# EasyEDA schematic SCH_Satlla_4_Front_side_2023-01-29.json
TITLE: Front_Side; REV: 1.0; Date: 2021-02-23; Sheet: 1/1; Drawn By: KCG LAB; Company: K&CG
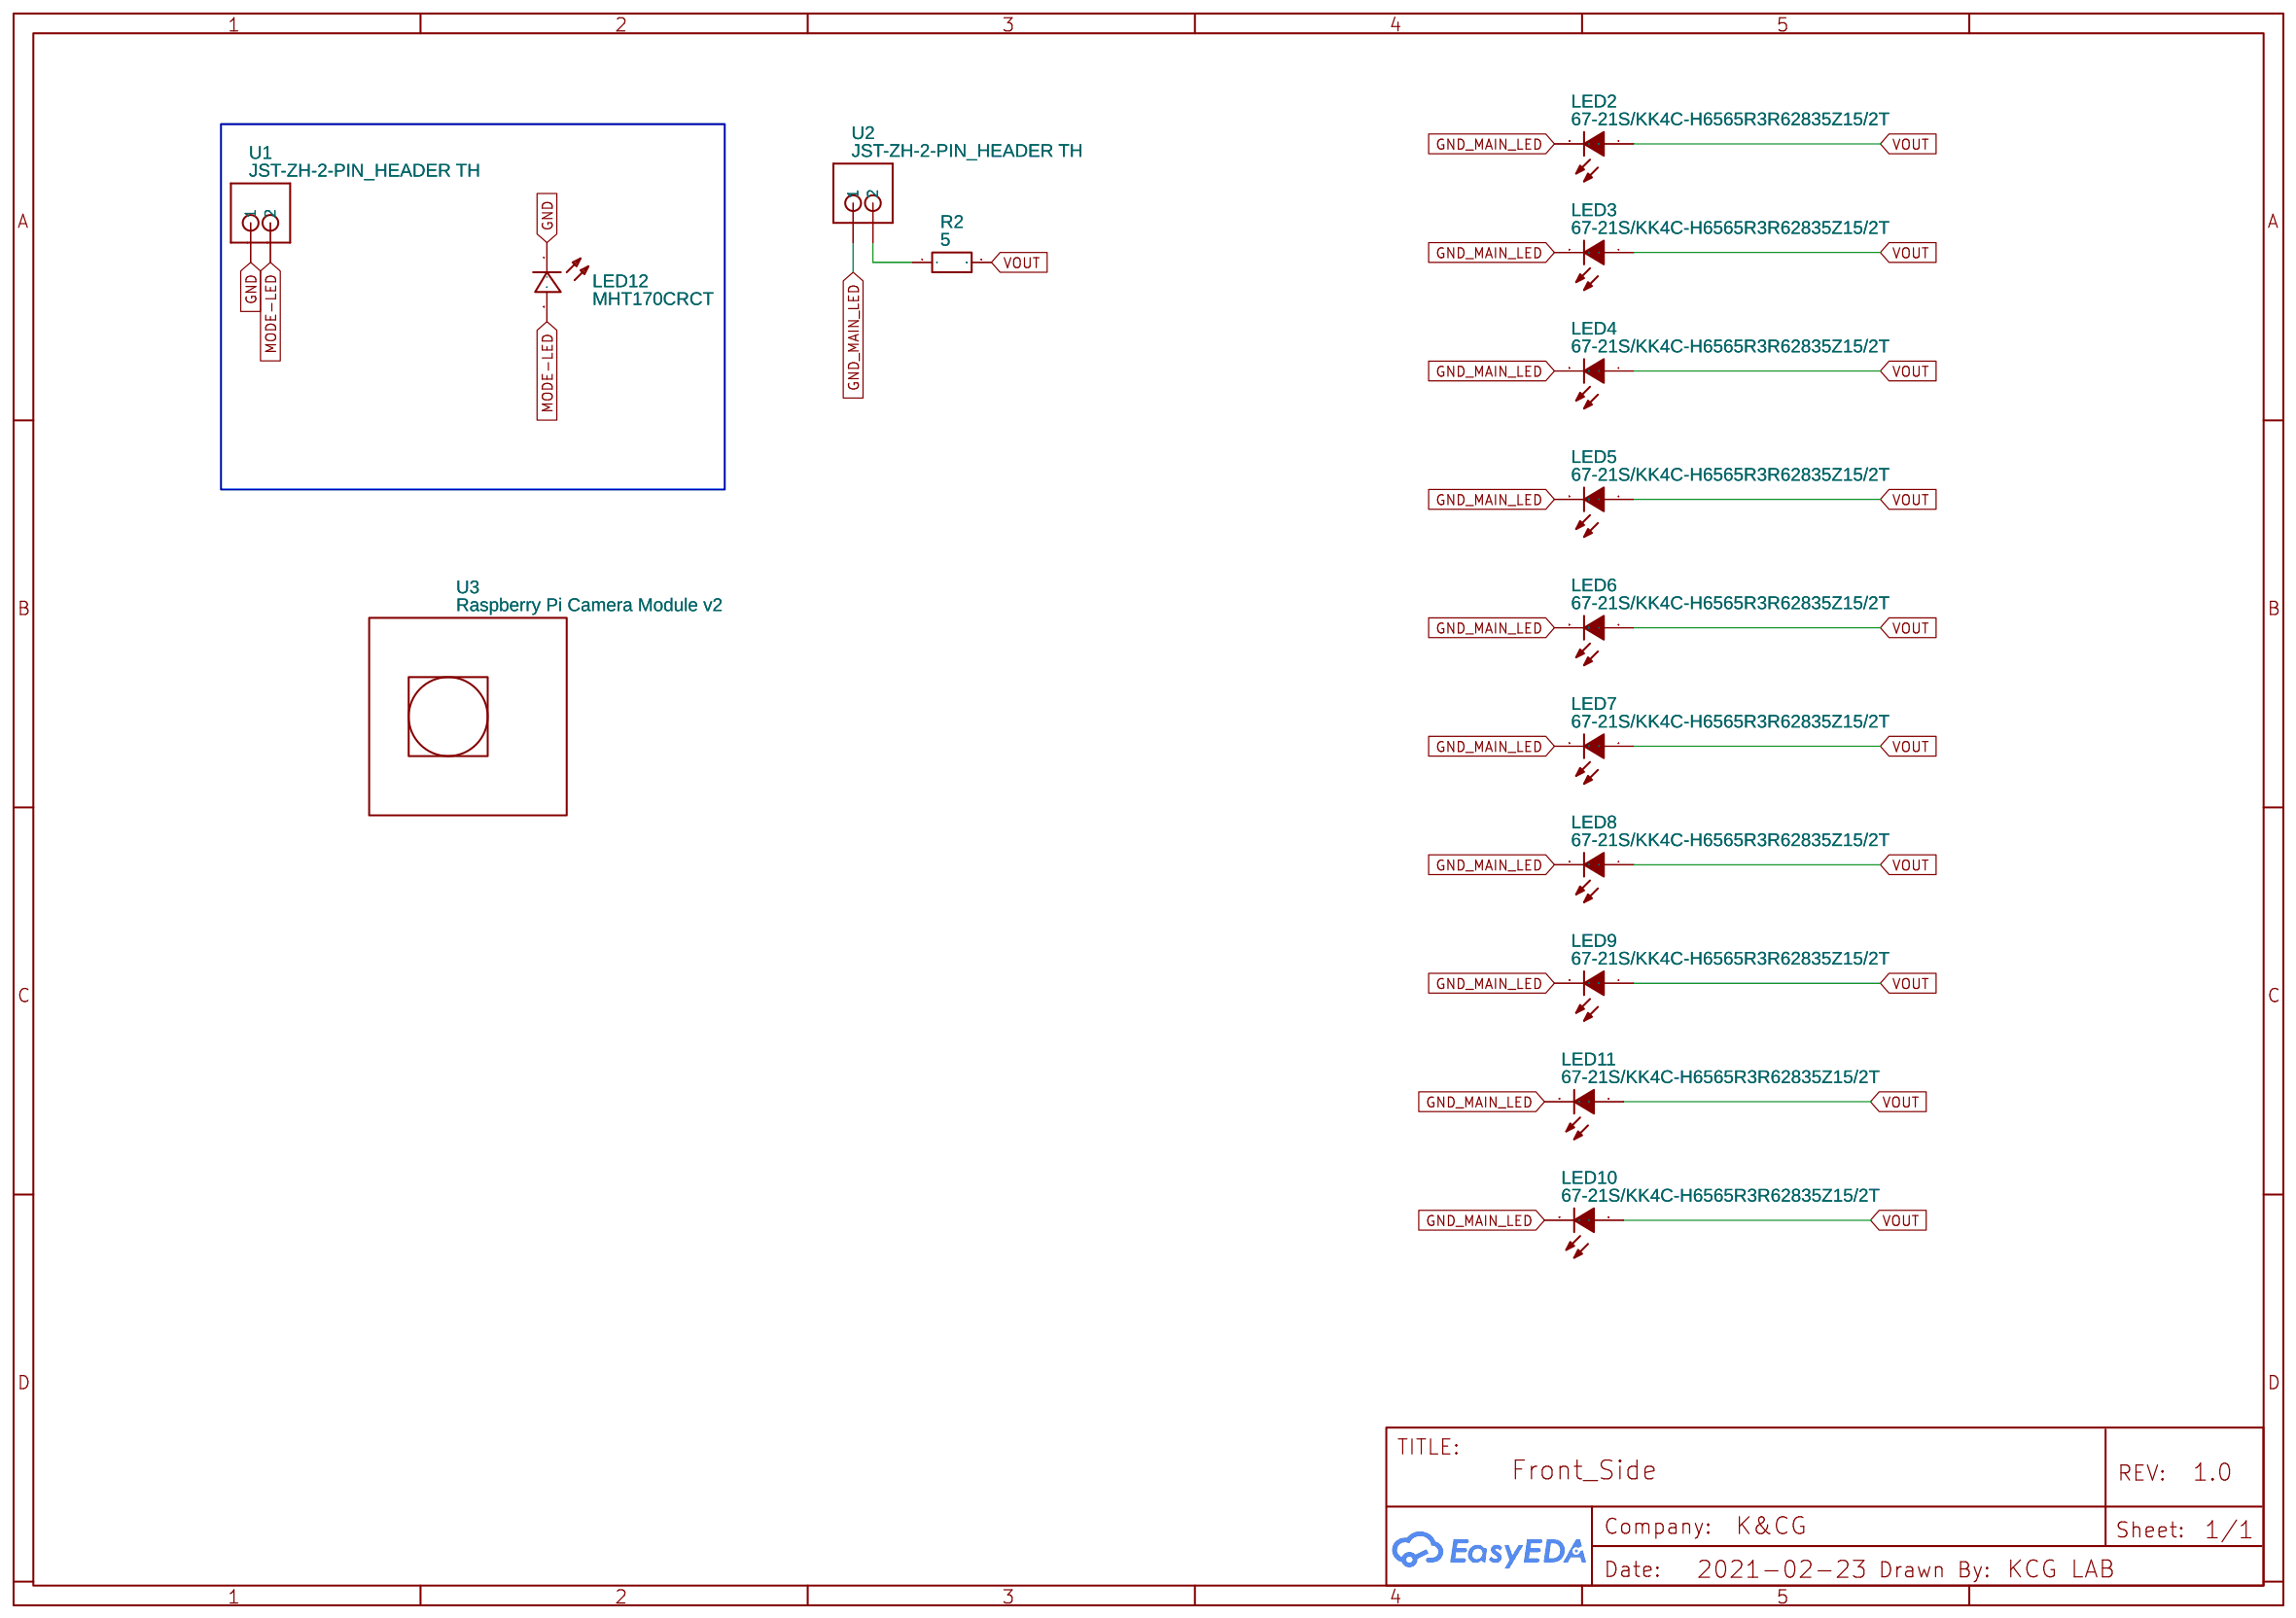
[diagram p0: schematic sheet]

## Parts
LED2  67-21S/KK4C-H6565R3R62835Z15/2T  [LED-SMD_L3.5-W2.8-R-RD]
LED3  67-21S/KK4C-H6565R3R62835Z15/2T  [LED-SMD_L3.5-W2.8-R-RD]
LED4  67-21S/KK4C-H6565R3R62835Z15/2T  [LED-SMD_L3.5-W2.8-R-RD]
LED5  67-21S/KK4C-H6565R3R62835Z15/2T  [LED-SMD_L3.5-W2.8-R-RD]
LED6  67-21S/KK4C-H6565R3R62835Z15/2T  [LED-SMD_L3.5-W2.8-R-RD]
LED7  67-21S/KK4C-H6565R3R62835Z15/2T  [LED-SMD_L3.5-W2.8-R-RD]
LED8  67-21S/KK4C-H6565R3R62835Z15/2T  [LED-SMD_L3.5-W2.8-R-RD]
LED9  67-21S/KK4C-H6565R3R62835Z15/2T  [LED-SMD_L3.5-W2.8-R-RD]
LED10  67-21S/KK4C-H6565R3R62835Z15/2T  [LED-SMD_L3.5-W2.8-R-RD]
LED11  67-21S/KK4C-H6565R3R62835Z15/2T  [LED-SMD_L3.5-W2.8-R-RD]
LED12  MHT170CRCT  [LED0805-RD]
R2  5  [R1210]
U1  JST-ZH-2-PIN_HEADER TH  [JST-ZH-2 1.5MM TH]
U2  JST-ZH-2-PIN_HEADER TH  [JST-ZH-2 1.5MM TH]
U3  Raspberry Pi Camera Module v2  [RASPBERRY PI CAMERA MODULE V2]

## Library data of the parts
LED2-LED11 = 67-21S/KK4C-H6565R3R62835Z15/2T: Supplier: LCSC; Manufacturer: EVERLIGHT; Supplier Part: C73545; JLCPCB Part Class: Extended Part
LED12 = MHT170CRCT: Supplier: LCSC; Supplier Part: C389523; Manufacturer: MEIHUA; Contributor: LCSC; JLCPCB Part Class: Extended Part
R2 = R_1210_EU: Contributor: LCEDA_Lib
U1 U2 = JST-ZH-2-PIN_HEADER TH: Contributor: Herve Goncalves
U3 = Raspberry Pi Camera Module v2: Contributor: tunx404

## Nets
GND: LED12.1(-) U1.1
GND_MAIN_LED: LED2.2(C) LED3.2(C) LED4.2(C) LED5.2(C) LED6.2(C) LED7.2(C) LED8.2(C) LED9.2(C) LED10.2(C) LED11.2(C) U2.1
MODE-LED: LED12.2(+) U1.2
VOUT: LED2.1(A) LED3.1(A) LED4.1(A) LED5.1(A) LED6.1(A) LED7.1(A) LED8.1(A) LED9.1(A) LED10.1(A) LED11.1(A) R2.2
Net-(R2-1): R2.1 U2.2
